# Altium schematic sheet CUK_3Ph_Power_Supplys.SchDoc: Cux GaN Grid connected control board
size A; Engineer: Ankit Gupta; Revision: V1.1
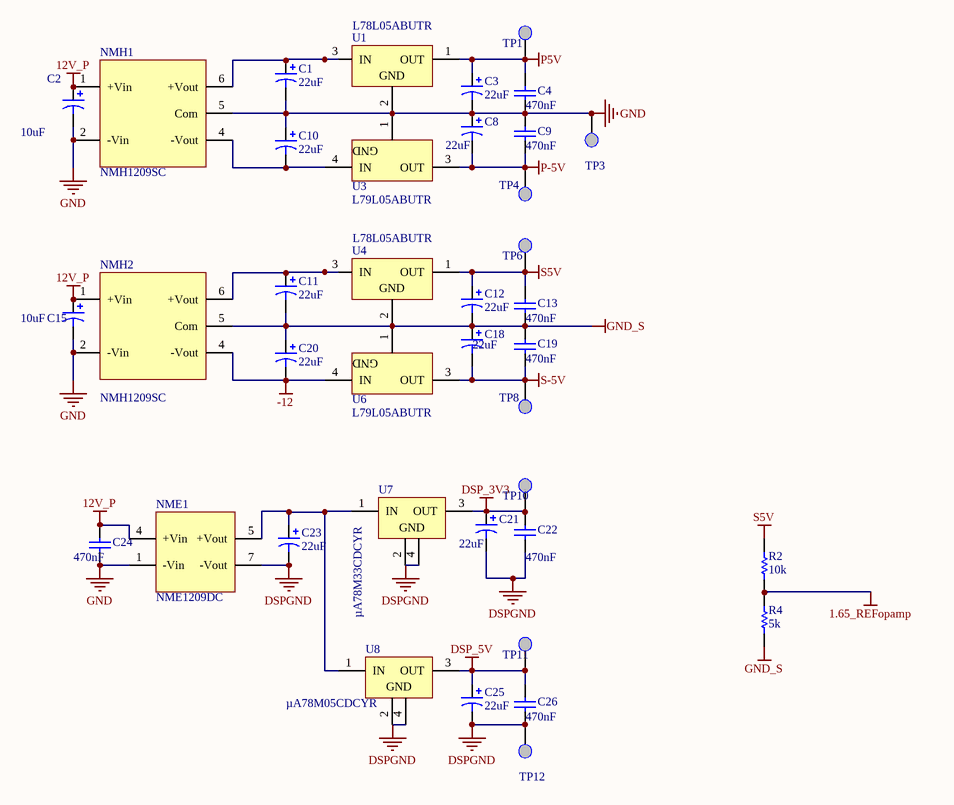
[diagram p0: CUK_3Ph_Power_Supplys.SchDoc]

## Parts
C1  value 22uF  [Cap tantal 22u-25V]  (hidden comment: Tantalium)
C2  value 10uF  [CAP-10u-16V]  (hidden comment: electrolytic)
C3  value 22uF  [Cap Tantal 3216]  (hidden comment: Tantalium/T520A226M006ATE090)
C4  value 470nF  [Capacitor 0805]  (hidden comment: Cap)
C8  value 22uF  [Cap Tantal 3216]  (hidden comment: Tantalium/T520A226M006ATE090)
C9  value 470nF  [Capacitor 0805]  (hidden comment: Cap)
C10  value 22uF  [Cap tantal 22u-25V]  (hidden comment: Tantalium)
C11  value 22uF  [Cap tantal 22u-25V]  (hidden comment: Tantalium)
C12  value 22uF  [Cap Tantal 3216]  (hidden comment: Tantalium/T520A226M006ATE090)
C13  value 470nF  [Capacitor 0805]  (hidden comment: Cap)
C15  value 10uF  [Cap elec 10u/16V]  (hidden comment: electrolytic)
C18  value 22uF  [Cap Tantal 3216]  (hidden comment: Tantalium/T520A226M006ATE090)
C19  value 470nF  [Capacitor 0805]  (hidden comment: Cap)
C20  value 22uF  [Cap tantal 22u-25V]  (hidden comment: Tantalium)
C21  value 22uF  [Cap Tantal 3216]  (hidden comment: Tantalium/T520A226M006ATE090)
C22  value 470nF  [Capacitor 0805]  (hidden comment: Cap)
C23  value 22uF  [Cap tantal 22u-25V]  (hidden comment: Tantalium)
C24  value 470nF  [Capacitor 0805]  (hidden comment: Cap)
C25  value 22uF  [Cap Tantal 3216]  (hidden comment: Tantalium/T520A226M006ATE090)
C26  value 470nF  [Capacitor 0805]  (hidden comment: Cap)
NME1  NME1209DC  [NME1209DC]
NMH1  NMH1209SC  [NMH1209SC]
NMH2  NMH1209SC  [NMH1209SC]
R2  value 10k  [0805 RES]  (hidden comment: Res1)
R4  value 5k  [0805 RES]  (hidden comment: Res1)
TP1  Test point  [Test Point]  (value not drawn)
TP3  Test point  [Test Point]  (value not drawn)
TP4  Test point  [Test Point]  (value not drawn)
TP6  Test point  [Test Point]  (value not drawn)
TP8  Test point  [Test Point]  (value not drawn)
TP10  Test point  [Test Point]  (value not drawn)
TP11  Test point  [Test Point]  (value not drawn)
TP12  Test point  [Test Point]  (value not drawn)
U1  L78L05ABUTR  [Reg SOT-89 +5]
U3  L79L05ABUTR  [Reg SOT-89]
U4  L78L05ABUTR  [Reg SOT-89 +5]
U6  L79L05ABUTR  [Reg SOT-89]
U7  µA78M33CDCYR  [Reg - SOT223]
U8  µA78M05CDCYR  [Reg - SOT223]

## Nets
1.65_REFopamp: R2.1 R4.2
12V_P: C2.1 C15.1 C24.2 NME1.4(+Vin) NMH1.1(+Vin) NMH2.1(+Vin)
-12: C20.2 NMH2.4(-Vout) U6.4(IN)
DSP_3V3: C21.1 C22.2 TP10.1 U7.3(OUT)
DSP_5V: C25.1 C26.2 TP11.1 U8.3(OUT)
DSPGND: C21.2 C22.1 C23.2 C25.2 C26.1 NME1.7(-Vout) TP12.1 U7.2(GND) U7.4(GND) U8.2(GND) U8.4(GND)
GND: C1.2 C2.2 C3.2 C4.1 C8.1 C9.2 C10.1 C15.2 C24.1 NME1.1(-Vin) NMH1.2(-Vin) NMH1.5(Com) NMH2.2(-Vin) TP3.1 U1.2(GND) U3.1(GND)
GND_S: C11.2 C12.2 C13.1 C18.1 C19.2 C20.1 NMH2.5(Com) R4.1 U4.2(GND) U6.1(GND)
P5V: C3.1 C4.2 TP1.1 U1.1(OUT)
P-5V: C8.2 C9.1 TP4.1 U3.3(OUT)
S5V: C12.1 C13.2 R2.2 TP6.1 U4.1(OUT)
S-5V: C18.2 C19.1 TP8.1 U6.3(OUT)
NetC1_1: C1.1 NMH1.6(+Vout) U1.3(IN)
NetC10_2: C10.2 NMH1.4(-Vout) U3.4(IN)
NetC11_1: C11.1 NMH2.6(+Vout) U4.3(IN)
NetC23_1: C23.1 NME1.5(+Vout) U7.1(IN) U8.1(IN)

## Library data of the parts
C1-C3 C8 C10-C12 C15 C18 C20 C21 C23 C25 = Cap Pol1: Polarized Capacitor (Radial); Published: 8-Jun-2000; LatestRevisionDate: 17-Jul-2002; LatestRevisionNote: Re-released for DXP Platform.; PackageReference: RB7.6-15; Publisher: Altium Limited
C4 C9 C13 C19 C22 C24 C26 = Cap: Capacitor; Published: 8-Jun-2000; LatestRevisionDate: 17-Jul-2002; LatestRevisionNote: Re-released for DXP Platform.; PackageReference: RAD-0.3; Publisher: Altium Limited
NME1 = NME----DC
NMH1 = NMH----SC_1
NMH2 = NMH----SC
R2 R4 = Res1: Resistor; Published: 8-Jun-2000; LatestRevisionDate: 17-Jul-2002; LatestRevisionNote: Re-released for DXP Platform.; PackageReference: AXIAL-0.3; Publisher: Altium Limited
U1 U4 = L78L05ABZ: Positive Voltage Regulator; Published: 24-Aug-2001; LatestRevisionDate: 17-Jul-2002; LatestRevisionNote: Re-released for DXP Platform.; DatasheetVersion: Feb-1999; PackageReference: TO92; Publisher: Altium Limited; PackageDescription: TO, Flat Index; 3 In-Line, Axial Leads; Body Dia. 4.8mm; Leads 0.51 x 0.51 mm (max); ComponentLink1Description: Manufacturer Link; ComponentLink1URL: http://www.st.com/
U3 U6 = µA79M05CKTPR: Negative-Voltage Regulator; Note: Pin 2 is electrically connected to pin4, and not drawn.; Published: 15-Apr-2002; DatasheetVersion: Apr-2000; PackageVersion: Jan-2001; PackageReference: KTP02; Publisher: Altium Limited; PackageDescription: PowerFLEX (D-PAK/TO-252-AA); 3 Leads (1 Cropped); Body 9.7 (inc. leads) x 6.2 mm (LxW max); Code_JEDEC: TO-252; ComponentLink1Description: Manufacturer Link; ComponentLink1URL: http://www.ti.com/; ComponentLink2Description: Datasheet; ComponentLink2URL: http://www-s.ti.com/sc/ds/ua79m05.pdf
U7 U8 = µA7805CKTER: Positive-Voltage Regulator; Note: Pin 2 is electrically connected to TAB/Pin4.; Published: 15-Apr-2002; DatasheetVersion: Jul-1999; PackageVersion: Jan-2001; PackageReference: KTE03; Publisher: Altium Limited; PackageDescription: PowerFLEX; 3 Leads; Body 10.7 (inc. leads) x 9.5 mm (LxW max); Code_JEDEC: MO-169; ComponentLink1Description: Manufacturer Link; ComponentLink1URL: http://www.ti.com/; ComponentLink2Description: Datasheet; ComponentLink2URL: http://www-s.ti.com/sc/ds/ua7805.pdf